# Altium schematic sheet DhruvThakur_PCBSchematic.SchDoc (part 3 of 5)
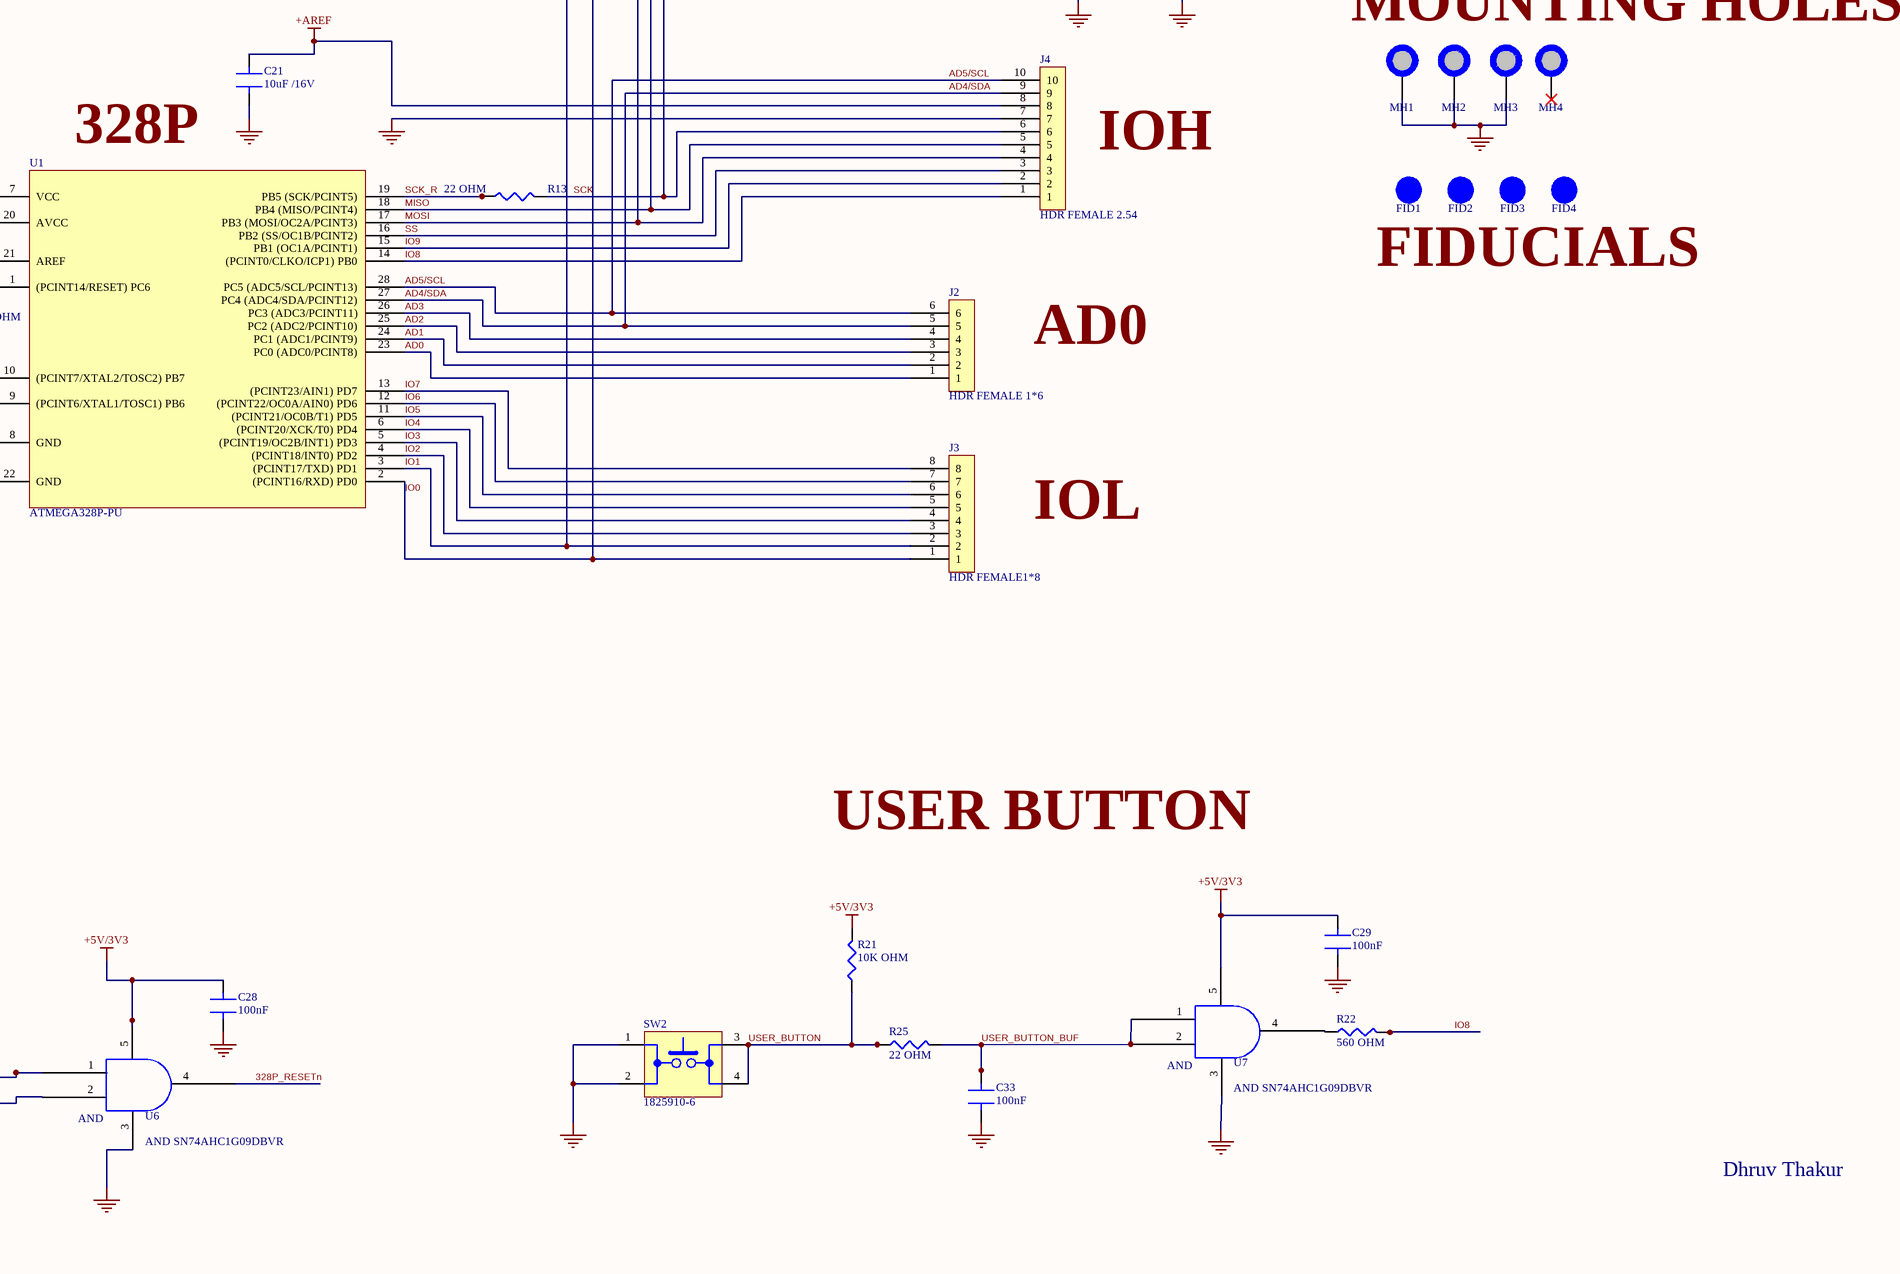
[diagram p5: DhruvThakur_PCBSchematic.SchDoc, bottom right]

## Library data of the parts (continued)
J4 = M20-7821046: Conn Socket Strip Receptacle 10 Position 2.54mm Solder Straight Through Hole Tube; Manufacturer: Harwin; Connector Type: Receptacle, Socket; Contact Resistance: 20mΩ; Current Rating: 3A; Dielectric Material: Polyamide; Hole Diameter: 800µm; Insulation Resistance: 1GΩ; Number of Contacts: 10; Operating Force: 4.8928N; Supplier 1: DigiKey; Manufacturer Part Number: M20-7821046; RoHS: Compliant; Category: Card Edge Connectors; Stock 1: 1361; Pricing 1: 1=1.37, 22=1.10409, 110=0.98555, 506=0.88482, 1012=0.84258, 5016=0.75263, 10010=0.71686 (USD); Case/Package: SIL; Color: Black; Contact Gender: Female; Contact Material: Bronze; Contact Plating: Tin; Depth: 2.5mm; Gender: Female; Housing Color: Black; Housing Material: Polyamide; Lead Pitch: 2.54mm; Length: 25.8mm; Lifecycle Status: Production; Max Current Rating: 3A; Max Operating Temperature: 105°C; Min Operating Temperature: -40°C; Mount: Through Hole; Number of Pins: 10; Number of Positions: 10; Number of Rows: 1; Orientation: Straight; Pitch: 2.54mm; Radiation Hardening: No; REACH SVHC: Yes; Terminal Pitch: 2.54mm; Termination: Solder; ComponentLink1URL: https://datasheet.octopart.com:443/M20-7821046-Harwin-datasheet-176383844.pdf?src-supplier=Electro+Sonic; ComponentLink1Description: https://datasheet.octopart.com:443/M20-7821046-Harwin-datasheet-176383844.pdf?src-supplier=Electro+Sonic; ComponentLink2URL: https://datasheet.octopart.com:443/M20-7821046-Harwin-datasheet-99119574.pdf?src-supplier=Upverter; ComponentLink2Description: https://datasheet.octopart.com:443/M20-7821046-Harwin-datasheet-99119574.pdf?src-supplier=Upverter; ComponentLink3URL: https://datasheet.octopart.com:443/M20-7821046-Harwin-datasheet-526273.pdf?src-supplier=Upverter; ComponentLink3Description: https://datasheet.octopart.com:443/M20-7821046-Harwin-datasheet-526273.pdf?src-supplier=Upverter; ComponentLink4URL: https://datasheet.octopart.com:443/M20-7821046-Harwin-datasheet-96624206.pdf?src-supplier=element14+APAC; ComponentLink4Description: https://datasheet.octopart.com:443/M20-7821046-Harwin-datasheet-96624206.pdf?src-supplier=element14+APAC; ComponentLink5URL: https://datasheet.octopart.com:443/M20-7821046-Harwin-datasheet-6396485.pdf?src-supplier=Newark; ComponentLink5Description: https://datasheet.octopart.com:443/M20-7821046-Harwin-datasheet-6396485.pdf?src-supplier=Newark; ComponentLink6URL: https://datasheet.octopart.com:443/M20-7821046-Harwin-datasheet-32864534.pdf?src-supplier=Newark; ComponentLink6Description: https://datasheet.octopart.com:443/M20-7821046-Harwin-datasheet-32864534.pdf?src-supplier=Newark; ComponentLink7URL: https://datasheet.octopart.com:443/M20-7821046-Harwin-datasheet-15888280.pdf?src-supplier=Newark; ComponentLink7Description: https://datasheet.octopart.com:443/M20-7821046-Harwin-datasheet-15888280.pdf?src-supplier=Newark; ComponentLink8URL: https://datasheet.octopart.com:443/M20-7821046-Harwin-datasheet-188872139.pdf?src-supplier=TME; ComponentLink8Description: https://datasheet.octopart.com:443/M20-7821046-Harwin-datasheet-188872139.pdf?src-supplier=TME; ComponentLink9URL: https://datasheet.octopart.com:443/M20-7821046-Harwin-datasheet-14706651.pdf?src-supplier=Farnell; ComponentLink9Description: https://datasheet.octopart.com:443/M20-7821046-Harwin-datasheet-14706651.pdf?src-supplier=Farnell; ComponentLink10URL: http://sigma.octopart.com:80/15888295/rohs_statement/Harwin-M20-7821046.pdf?src-supplier=Compliance+Statements; ComponentLink10Description: http://sigma.octopart.com:80/15888295/rohs_statement/Harwin-M20-7821046.pdf?src-supplier=Compliance+Statements; Supplier Part Number 1: 952-1847-ND
J5 J6 = 67997-106HLF: Conn; Rect; Header; Unshrouded; 6 Pos; 2.54mm Pitch; 2-Row; Thru-Hole; BergStik; Manufacturer: Amphenol Communications Solutions; Connector Type: Male Pin; Current Rating: 5A; Dielectric Material: Polyethylene; Insulation Resistance: 5GΩ; Lead Length: 3.05mm; Mating Post Length: 5.84mm; Max Voltage Rating (AC): 1.5kV; Number of Contacts: 6; Supplier 1: DigiKey; Manufacturer Part Number: 67997-106HLF; RoHS: Compliant; Category: Headers and Wire Housings; Stock 1: 4552; Pricing 1: 1=0.58, 10=0.49, 400=0.37728, 800=0.35925, 1200=0.34911, 5200=0.31479, 10000=0.3006 (USD); China RoHS: Compliant; Color: Black; Contact Gender: Male; Contact Material: Bronze; Contact Mating Length: 5.842mm; Contact Plating: Gold; Depth: 4.83mm; Flammability Rating: UL94 V-0; Gender: Male; Housing Color: Black; Housing Material: Thermoplastic; Lead Free: Lead Free; Lead Pitch: 2.54mm; Length: 7.62mm; Lifecycle Status: Production; Max Operating Temperature: 130°C; Min Operating Temperature: -65°C; Mount: Through Hole; Number of Pins: 6; Number of Positions: 6; Number of Rows: 2; Orientation: Straight; Pitch: 2.54mm; Radiation Hardening: No; REACH SVHC: Yes; Row Spacing: 2.54mm; Schedule B: 8535908040, 8535908040|8535908040|8535908040|8535908040|8535908040|8535908040|8535908040|8535908040|8535908040|8535908040|8535908040|8535908040|8535908040|8535908040|8535908040|8535908040|8535908040|8535908040|8535908040|8535908040|8535908040|8535908040|8535908040|85; Terminal Pitch: 2.54mm; Termination: Through Hole; Voltage Rating: 1.5kV; ComponentLink1URL: https://datasheet.octopart.com:443/67997-106HLF-Amphenol-Communications-Solutions-datasheet-10288749.pdf?src-supplier=Newark; ComponentLink1Description: https://datasheet.octopart.com:443/67997-106HLF-Amphenol-Communications-Solutions-datasheet-10288749.pdf?src-supplier=Newark; ComponentLink2URL: https://datasheet.octopart.com:443/67997-106HLF-Areva-datasheet-10052131.pdf?src-supplier=Newark; ComponentLink2Description: https://datasheet.octopart.com:443/67997-106HLF-Areva-datasheet-10052131.pdf?src-supplier=Newark; ComponentLink3URL: https://datasheet.octopart.com:443/67997-106HLF-Areva-datasheet-8877144.pdf?src-supplier=Newark; ComponentLink3Description: https://datasheet.octopart.com:443/67997-106HLF-Areva-datasheet-8877144.pdf?src-supplier=Newark; ComponentLink4URL: https://datasheet.octopart.com:443/67997-106HLF-Areva-datasheet-8731571.pdf?src-supplier=Newark; ComponentLink4Description: https://datasheet.octopart.com:443/67997-106HLF-Areva-datasheet-8731571.pdf?src-supplier=Newark; ComponentLink5URL: https://datasheet.octopart.com:443/67997-106HLF-Areva-datasheet-8486089.pdf?src-supplier=Newark; ComponentLink5Description: https://datasheet.octopart.com:443/67997-106HLF-Areva-datasheet-8486089.pdf?src-supplier=Newark; ComponentLink6URL: https://datasheet.octopart.com:443/67997-106HLF-Amphenol-Communications-Solutions-datasheet-36854132.pdf?src-supplier=Farnell; ComponentLink6Description: https://datasheet.octopart.com:443/67997-106HLF-Amphenol-Communications-Solutions-datasheet-36854132.pdf?src-supplier=Farnell; ComponentLink7URL: https://datasheet.octopart.com:443/67997-106HLF-Amphenol-Communications-Solutions-datasheet-20739478.pdf?src-supplier=RS+(Formerly+Allied+Electronics); ComponentLink7Description: https://datasheet.octopart.com:443/67997-106HLF-Amphenol-Communications-Solutions-datasheet-20739478.pdf?src-supplier=RS+(Formerly+Allied+Electronics); ComponentLink8URL: https://datasheet.octopart.com:443/67997-106HLF-Areva-datasheet-118652.pdf?src-supplier=DigiKey; ComponentLink8Description: https://datasheet.octopart.com:443/67997-106HLF-Areva-datasheet-118652.pdf?src-supplier=DigiKey; Supplier Part Number 1: 609-3393-ND
J7 = 10118193-0001LF: USB - micro B USB 2.0 Receptacle Connector 5 Position Surface Mount, Right Angle, Horizontal; Manufacturer: Amphenol Communications Solutions; Connector Type: Receptacle, USB; Contact Resistance: 30mΩ; Current Rating: 1.8A; Dielectric Material: Liquid Crystal Polymer; Insulation Resistance: 1GΩ; Max Voltage Rating (AC): 100V; Number of Contacts: 5; Number of Ports: 1; Operating Force: 35.1392N; Pitch: 650µm; Plating Thickness: 762nm; USB Standard: USB 2.0; Supplier 1: DigiKey; Manufacturer Part Number: 10118193-0001LF; RoHS: Compliant; Category: USB Connectors; Stock 1: 79719; Pricing 1: 1=0.43, 10=0.367, 25=0.3436, 50=0.3272, 100=0.3116, 250=0.29204, 500=0.27808 (USD); China RoHS: Compliant; Color: Black; Contact Gender: Female; Contact Material: Gold, Nickel; Contact Plating: Gold; Depth: 5.67mm; Features: Shielded; Flammability Rating: UL94 V-0; Height: 3mm; Housing Material: Polymer; Length: 7.86mm; Lifecycle Status: Production; Max Operating Temperature: 80°C; Min Operating Temperature: -55°C; Mount: Horizontal, Surface Mount; Number of Pins: 5; Number of Rows: 1; Number of Terminals: 5; Orientation: Right Angle; Radiation Hardening: No; REACH SVHC: Yes; Shell Material: Stainless Steel; Terminal Pitch: 660.4µm; Termination: Solder; Voltage Rating: 100V; ComponentLink1URL: https://datasheet.octopart.com:443/10118193-0001LF-Amphenol-Communications-Solutions-datasheet-182239125.pdf?src-supplier=IHS; ComponentLink1Description: https://datasheet.octopart.com:443/10118193-0001LF-Amphenol-Communications-Solutions-datasheet-182239125.pdf?src-supplier=IHS; ComponentLink2URL: https://datasheet.octopart.com:443/10118193-0001LF-Amphenol-Communications-Solutions-datasheet-55953155.pdf?src-supplier=TME; ComponentLink2Description: https://datasheet.octopart.com:443/10118193-0001LF-Amphenol-Communications-Solutions-datasheet-55953155.pdf?src-supplier=TME; ComponentLink3URL: https://datasheet.octopart.com:443/10118193-0001LF-Amphenol-ICC-datasheet-116246833.pdf?src-supplier=Upverter; ComponentLink3Description: https://datasheet.octopart.com:443/10118193-0001LF-Amphenol-ICC-datasheet-116246833.pdf?src-supplier=Upverter; ComponentLink4URL: https://datasheet.octopart.com:443/10118193-0001LF-FCI-datasheet-141913714.pdf?src-supplier=Upverter; ComponentLink4Description: https://datasheet.octopart.com:443/10118193-0001LF-FCI-datasheet-141913714.pdf?src-supplier=Upverter; ComponentLink5URL: https://datasheet.octopart.com:443/10118193-0001LF-Amphenol-Communications-Solutions-datasheet-96019471.pdf?src-supplier=element14+APAC; ComponentLink5Description: https://datasheet.octopart.com:443/10118193-0001LF-Amphenol-Communications-Solutions-datasheet-96019471.pdf?src-supplier=element14+APAC; ComponentLink6URL: https://datasheet.octopart.com:443/10118193-0001LF-Amphenol-Communications-Solutions-datasheet-11792339.pdf?src-supplier=Electro+Sonic; ComponentLink6Description: https://datasheet.octopart.com:443/10118193-0001LF-Amphenol-Communications-Solutions-datasheet-11792339.pdf?src-supplier=Electro+Sonic; ComponentLink7URL: https://datasheet.octopart.com:443/10118193-0001LF-Amphenol-Communications-Solutions-datasheet-13702206.pdf?src-supplier=RS+(Formerly+Allied+Electronics); ComponentLink7Description: https://datasheet.octopart.com:443/10118193-0001LF-Amphenol-Communications-Solutions-datasheet-13702206.pdf?src-supplier=RS+(Formerly+Allied+Electronics); Supplier Part Number 1: 609-4616-6-ND
J8 J9 = PAD_WITH_HOLE_4MMX1.5MM
JP1 JP4 = 68000-103HLF: Pin Header, Board-to-Board, 2.54 mm, 1 Rows, 3 Contacts, Through Hole, FCI BergStik II 68000; Manufacturer: Amphenol Communications Solutions; Connector Type: Male Pin; Current Rating: 3A; Dielectric Material: Polyethylene; Gender: Male; Insulation Resistance: 5GΩ; Lead Length: 2.41mm; Mating Post Length: 5.84mm; Max Voltage Rating (AC): 1.5kV; Number of Contacts: 3; Pitch: 2.54mm; Plating Thickness: 762nm; Voltage Rating: 1.05kV; Supplier 1: DigiKey; Manufacturer Part Number: 68000-103HLF; RoHS: Compliant; Category: Headers and Wire Housings; Stock 1: 65511; Pricing 1: 1=0.31, 10=0.266, 100=0.2257, 500=0.20142, 4000=0.17391, 8000=0.1656, 12000=0.16093 (USD); China RoHS: Compliant; Color: Black; Contact Gender: Male; Contact Material: Gold; Contact Mating Length: 5.842mm; Contact Plating: Gold; Depth: 2.41mm; Flammability Rating: UL94 V-0; Height: 8.73mm; Housing Color: Black; Housing Material: Thermoplastic; Lead Pitch: 2.54mm; Length: 7.62mm; Lifecycle Status: Production; Max Operating Temperature: 125°C; Min Operating Temperature: -65°C; Mount: Through Hole; Number of Pins: 3; Number of Positions: 3; Number of Rows: 1; Orientation: Straight; Packaging: Bulk; Radiation Hardening: No; REACH SVHC: Yes; Terminal Pitch: 2.54mm; Termination: Solder; ComponentLink1URL: https://datasheet.octopart.com:443/68000-103HLF-Amphenol-ICC---FCI-datasheet-155511504.pdf?src-supplier=Upverter; ComponentLink1Description: https://datasheet.octopart.com:443/68000-103HLF-Amphenol-ICC---FCI-datasheet-155511504.pdf?src-supplier=Upverter; ComponentLink2URL: https://datasheet.octopart.com:443/68000-103HLF-Amphenol-Communications-Solutions-datasheet-10088795.pdf?src-supplier=Farnell; ComponentLink2Description: https://datasheet.octopart.com:443/68000-103HLF-Amphenol-Communications-Solutions-datasheet-10088795.pdf?src-supplier=Farnell; ComponentLink3URL: https://datasheet.octopart.com:443/68000-103HLF-Amphenol-Communications-Solutions-datasheet-41232361.pdf?src-supplier=Farnell; ComponentLink3Description: https://datasheet.octopart.com:443/68000-103HLF-Amphenol-Communications-Solutions-datasheet-41232361.pdf?src-supplier=Farnell; ComponentLink4URL: https://datasheet.octopart.com:443/68000-103HLF-Areva-datasheet-8861575.pdf?src-supplier=Newark; ComponentLink4Description: https://datasheet.octopart.com:443/68000-103HLF-Areva-datasheet-8861575.pdf?src-supplier=Newark; ComponentLink5URL: https://datasheet.octopart.com:443/68000-103HLF-Areva-datasheet-8713716.pdf?src-supplier=Newark; ComponentLink5Description: https://datasheet.octopart.com:443/68000-103HLF-Areva-datasheet-8713716.pdf?src-supplier=Newark; ComponentLink6URL: https://datasheet.octopart.com:443/68000-103HLF-Areva-datasheet-8449737.pdf?src-supplier=Newark; ComponentLink6Description: https://datasheet.octopart.com:443/68000-103HLF-Areva-datasheet-8449737.pdf?src-supplier=Newark; ComponentLink7URL: https://datasheet.octopart.com:443/68000-103HLF-Amphenol-Communications-Solutions-datasheet-154727322.pdf?src-supplier=Electro+Sonic; ComponentLink7Description: https://datasheet.octopart.com:443/68000-103HLF-Amphenol-Communications-Solutions-datasheet-154727322.pdf?src-supplier=Electro+Sonic; ComponentLink8URL: https://datasheet.octopart.com:443/68000-103HLF-Amphenol-Communications-Solutions-datasheet-100449246.pdf?src-supplier=TME; ComponentLink8Description: https://datasheet.octopart.com:443/68000-103HLF-Amphenol-Communications-Solutions-datasheet-100449246.pdf?src-supplier=TME; ComponentLink9URL: https://datasheet.octopart.com:443/68000-103HLF-Amphenol-datasheet-170317325.pdf?src-supplier=Amar+Radio+Corporation; ComponentLink9Description: https://datasheet.octopart.com:443/68000-103HLF-Amphenol-datasheet-170317325.pdf?src-supplier=Amar+Radio+Corporation; ComponentLink10URL: https://datasheet.octopart.com:443/68000-103HLF-Amphenol-Communications-Solutions-datasheet-13448982.pdf?src-supplier=RS+(Formerly+Allied+Electronics); ComponentLink10Description: https://datasheet.octopart.com:443/68000-103HLF-Amphenol-Communications-Solutions-datasheet-13448982.pdf?src-supplier=RS+(Formerly+Allied+Electronics); Supplier Part Number 1: 609-3461-ND
JP2 = 10-89-7041: Conn Unshrouded Header HDR 4 POS 2.54mm Solder ST Top Entry Thru-HoleC-Grid Bag; Manufacturer: Molex; Manufacturer Lifecycle Status: ACTIVE; Connector Type: Male Pin; Contact Resistance: 15mΩ; Current Rating: 3A; Dielectric Material: Polyethylene; Glow Wire Compliant: Non-compliant; Insulation Resistance: 1GΩ; Number of Circuits: 4; Plating: Tin; Plating Thickness: 3.81µm; Voltage Rating: 250V; Supplier 1: DigiKey; Manufacturer Part Number: 10-89-7041; RoHS: Compliant; Category: Headers and Wire Housings; Stock 1: 4005; Pricing 1: 1=0.56, 10=0.472, 100=0.4007, 500=0.35766, 1000=0.34057, 5000=0.304, 10000=0.2895 (USD); China RoHS: Compliant; Color: Black; Contact Gender: Male; Contact Material: Brass; Contact Mating Length: 6.096mm; Contact Plating: Tin; Country of Origin: US; ELV: Compliant; Flammability Rating: UL94 V-0; Halogen Free: Low Halogen; Housing Color: Black; Housing Material: Thermoplastic; Lead Free: Lead Free; Lead Pitch: 2.54mm; Lifecycle Status: Production; Max Operating Temperature: 105°C; Min Operating Temperature: -40°C; Mount: Through Hole; Number of Contacts: 4; Number of Pins: 4; Number of Positions: 4; Number of Rows: 2; Orientation: Vertical; Packaging: Bulk; Pitch: 2.54mm; REACH SVHC: Yes; Row Spacing: 2.54mm; Terminal Pitch: 2.54mm; Termination: Solder; Voltage Rating (DC): 250V; ComponentLink1URL: https://datasheet.octopart.com:443/10-89-7041-Molex-datasheet-138896924.pdf?src-supplier=Newark; ComponentLink1Description: https://datasheet.octopart.com:443/10-89-7041-Molex-datasheet-138896924.pdf?src-supplier=Newark; ComponentLink2URL: https://datasheet.octopart.com:443/10-89-7041-Molex-datasheet-13784515.pdf?src-supplier=Molex; ComponentLink2Description: https://datasheet.octopart.com:443/10-89-7041-Molex-datasheet-13784515.pdf?src-supplier=Molex; ComponentLink3URL: https://sigma.octopart.com:443/8377736/technical_drawing/Molex-10-89-7041.pdf?src-supplier=Molex; ComponentLink3Description: https://sigma.octopart.com:443/8377736/technical_drawing/Molex-10-89-7041.pdf?src-supplier=Molex; ComponentLink4URL: https://datasheet.octopart.com:443/010897041-Molex-datasheet-8335915.pdf?src-supplier=Molex; ComponentLink4Description: https://datasheet.octopart.com:443/010897041-Molex-datasheet-8335915.pdf?src-supplier=Molex; ComponentLink5URL: https://datasheet.octopart.com:443/10-89-7041-Molex-datasheet-154742889.pdf?src-supplier=Master+Electronics; ComponentLink5Description: https://datasheet.octopart.com:443/10-89-7041-Molex-datasheet-154742889.pdf?src-supplier=Master+Electronics; ComponentLink6URL: https://datasheet.octopart.com:443/10-89-7041-Molex-datasheet-62102714.pdf?src-supplier=Electro+Sonic; ComponentLink6Description: https://datasheet.octopart.com:443/10-89-7041-Molex-datasheet-62102714.pdf?src-supplier=Electro+Sonic; ComponentLink7URL: https://datasheet.octopart.com:443/10-89-7041-Molex-datasheet-37167734.pdf?src-supplier=Electro+Sonic; ComponentLink7Description: https://datasheet.octopart.com:443/10-89-7041-Molex-datasheet-37167734.pdf?src-supplier=Electro+Sonic; ComponentLink8URL: https://datasheet.octopart.com:443/10-89-7041-Molex-datasheet-23708294.pdf?src-supplier=Electro+Sonic; ComponentLink8Description: https://datasheet.octopart.com:443/10-89-7041-Molex-datasheet-23708294.pdf?src-supplier=Electro+Sonic; ComponentLink9URL: https://datasheet.octopart.com:443/10-89-7041-Molex-datasheet-154284.pdf?src-supplier=Mouser; ComponentLink9Description: https://datasheet.octopart.com:443/10-89-7041-Molex-datasheet-154284.pdf?src-supplier=Mouser; ComponentLink10URL: https://datasheet.octopart.com:443/10-89-7041-Molex-datasheet-120117.pdf?src-supplier=DigiKey; ComponentLink10Description: https://datasheet.octopart.com:443/10-89-7041-Molex-datasheet-120117.pdf?src-supplier=DigiKey; ComponentLink11URL: http://sigma.octopart.com:80/15617102/rohs_certificate/Molex-10-89-7041.pdf?src-supplier=Compliance+Statements; ComponentLink11Description: http://sigma.octopart.com:80/15617102/rohs_certificate/Molex-10-89-7041.pdf?src-supplier=Compliance+Statements; ComponentLink12URL: http://sigma.octopart.com:80/conflict_mineral_statement/Molex-company-72.pdf?src-supplier=Compliance+Statements; ComponentLink12Description: http://sigma.octopart.com:80/conflict_mineral_statement/Molex-company-72.pdf?src-supplier=Compliance+Statements; ComponentLink13URL: http://sigma.octopart.com:80/rohs_statement/Molex-company-73.pdf?src-supplier=Compliance+Statements; ComponentLink13Description: http://sigma.octopart.com:80/rohs_statement/Molex-company-73.pdf?src-supplier=Compliance+Statements; ComponentLink14URL: http://sigma.octopart.com:80/reach_statement/Molex-company-74.pdf?src-supplier=Compliance+Statements; ComponentLink14Description: http://sigma.octopart.com:80/reach_statement/Molex-company-74.pdf?src-supplier=Compliance+Statements; Supplier Part Number 1: WM50022-04-ND
JP3 = 68001-204HLF: Conn Unshrouded Header HDR 4 POS 2.54mm Solder ST Top Entry Thru-Hole BergStik® Bulk; Manufacturer: Amphenol Communications Solutions; Connector Type: Male Pin; Current Rating: 3A; Gender: Male; Insulation Resistance: 5GΩ; Lead Length: 3.05mm; Mating Post Length: 5.84mm; Number of Contacts: 4; Voltage Rating: 1.5kV; Supplier 1: DigiKey; Manufacturer Part Number: 68001-204HLF; RoHS: Compliant; Category: Headers and Wire Housings; Stock 1: 2342; Pricing 1: 1=0.47, 10=0.401, 100=0.3406, 500=0.30394, 1000=0.28942, 5000=0.25834, 10000=0.24602 (USD); China RoHS: Compliant; Color: Black; Contact Gender: Male; Contact Material: Bronze; Contact Mating Length: 5.842mm; Contact Plating: GXT, Gold; Flammability Rating: UL94 V-0; Housing Material: Thermoplastic; Lead Pitch: 2.54mm; Lifecycle Status: Production; Max Operating Temperature: 130°C; Min Operating Temperature: -65°C; Mount: Through Hole; Number of Pins: 4; Number of Positions: 4; Number of Rows: 1; Orientation: Straight; Packaging: Bulk; Pitch: 2.54mm; Radiation Hardening: No; REACH SVHC: Yes; Schedule B: 8535908040; Terminal Pitch: 2.54mm; Termination: Solder; ComponentLink1URL: https://datasheet.octopart.com:443/68001-204HLF-Amphenol-Communications-Solutions-datasheet-151206381.pdf?src-supplier=IHS; ComponentLink1Description: https://datasheet.octopart.com:443/68001-204HLF-Amphenol-Communications-Solutions-datasheet-151206381.pdf?src-supplier=IHS; ComponentLink2URL: https://datasheet.octopart.com:443/68001-204HLF-Amphenol-Communications-Solutions-datasheet-154727322.pdf?src-supplier=Master+Electronics; ComponentLink2Description: https://datasheet.octopart.com:443/68001-204HLF-Amphenol-Communications-Solutions-datasheet-154727322.pdf?src-supplier=Master+Electronics; ComponentLink3URL: https://datasheet.octopart.com:443/68001-204HLF-Amphenol-Communications-Solutions-datasheet-41232361.pdf?src-supplier=element14+APAC; ComponentLink3Description: https://datasheet.octopart.com:443/68001-204HLF-Amphenol-Communications-Solutions-datasheet-41232361.pdf?src-supplier=element14+APAC; ComponentLink4URL: https://datasheet.octopart.com:443/68001-204HLF-Amphenol-Communications-Solutions-datasheet-100449246.pdf?src-supplier=Future+Electronics; ComponentLink4Description: https://datasheet.octopart.com:443/68001-204HLF-Amphenol-Communications-Solutions-datasheet-100449246.pdf?src-supplier=Future+Electronics; ComponentLink5URL: https://datasheet.octopart.com:443/68001-204HLF-Amphenol-Communications-Solutions-datasheet-20739502.pdf?src-supplier=RS+(Formerly+Allied+Electronics); ComponentLink5Description: https://datasheet.octopart.com:443/68001-204HLF-Amphenol-Communications-Solutions-datasheet-20739502.pdf?src-supplier=RS+(Formerly+Allied+Electronics); Supplier Part Number 1: 609-3402-ND
L1 = BRL3225T2R2M: Inductor Power Chip Wirewound 2.2uH 20% 100KHz Ferrite 1.6A 78mOhm DCR 1210 T/R; Manufacturer: Taiyo Yuden; DC Resistance (DCR): 78mΩ; Inductance: 2.2µH; Max Saturation Current: 1.85A; Number of Circuits: 1; Self Resonant Frequency: 150MHz; Shielding: No; Supplier 1: DigiKey; Manufacturer Part Number: BRL3225T2R2M; RoHS: Compliant; Category: Fixed Inductors; Stock 1: 13918; Pricing 1: 1=0.18, 10=0.146, 100=0.1199, 1000=0.09857, 2000=0.09294, 4000=0.08763, 6000=0.08467, 10000=0.08108, 14000=0.07881, 20000=0.07646, 50000=0.07077, 100000=0.06859 (USD); Case/Package: 1210; Case Code (Imperial): 1210; Case Code (Metric): 3225; Composition: Wirewound; Core Material: Ferrite; Current Rating: 1.6A; DC Current: 1.6A; Depth: 2.7mm; Halogen Free: Halogen Free; Height: 1.7mm; Height - Seated (Max): 1.7018mm; Inductance Tolerance: 20%; Length: 3.2mm; Lifecycle Status: Production; Max Current Rating: 1.6A; Max DC Current: 1.6A; Max Length: 3.4mm; Max Operating Temperature: 105°C; Max Temperature Rise Current: 1.6A; Max Width: 2.7mm; Military Standard: Not; Min Length: 3mm; Min Operating Temperature: -40°C; Min Width: 2.3mm; Mount: Surface Mount; Number of Pins: 2; Number of Terminals: 2; Radiation Hardening: No; REACH SVHC: Yes; Saturation Current: 1.85A; Termination: SMD/SMT; Test Frequency: 100kHz; Tolerance: 20%; Width: 2.5mm; ComponentLink1URL: https://datasheet.octopart.com:443/BRL3225T2R2M-Taiyo-Yuden-datasheet-181258246.pdf?src-supplier=element14+APAC; ComponentLink1Description: https://datasheet.octopart.com:443/BRL3225T2R2M-Taiyo-Yuden-datasheet-181258246.pdf?src-supplier=element14+APAC; ComponentLink2URL: https://datasheet.octopart.com:443/BRL3225T2R2M-Taiyo-Yuden-datasheet-41181393.pdf?src-supplier=element14+APAC; ComponentLink2Description: https://datasheet.octopart.com:443/BRL3225T2R2M-Taiyo-Yuden-datasheet-41181393.pdf?src-supplier=element14+APAC; ComponentLink3URL: https://datasheet.octopart.com:443/BRL3225T2R2M-Taiyo-Yuden-datasheet-17271620.pdf?src-supplier=Farnell; ComponentLink3Description: https://datasheet.octopart.com:443/BRL3225T2R2M-Taiyo-Yuden-datasheet-17271620.pdf?src-supplier=Farnell; ComponentLink4URL: https://datasheet.octopart.com:443/BRL3225T2R2M-Taiyo-Yuden-datasheet-154807570.pdf?src-supplier=JRH+Electronics; ComponentLink4Description: https://datasheet.octopart.com:443/BRL3225T2R2M-Taiyo-Yuden-datasheet-154807570.pdf?src-supplier=JRH+Electronics; ComponentLink5URL: https://datasheet.octopart.com:443/BRL3225T2R2M-Taiyo-Yuden-datasheet-65850814.pdf?src-supplier=Newark; ComponentLink5Description: https://datasheet.octopart.com:443/BRL3225T2R2M-Taiyo-Yuden-datasheet-65850814.pdf?src-supplier=Newark; ComponentLink6URL: https://datasheet.octopart.com:443/BRL3225T2R2M-Taiyo-Yuden-datasheet-13712620.pdf?src-supplier=Factory+Futures; ComponentLink6Description: https://datasheet.octopart.com:443/BRL3225T2R2M-Taiyo-Yuden-datasheet-13712620.pdf?src-supplier=Factory+Futures; ComponentLink7URL: https://datasheet.octopart.com:443/BRL3225T2R2M-Taiyo-Yuden-datasheet-141251735.pdf?src-supplier=Taiyo+Yuden+SCT; ComponentLink7Description: https://datasheet.octopart.com:443/BRL3225T2R2M-Taiyo-Yuden-datasheet-141251735.pdf?src-supplier=Taiyo+Yuden+SCT; ComponentLink8URL: https://datasheet.octopart.com:443/BRL3225T2R2M-Taiyo-Yuden-datasheet-134564583.pdf?src-supplier=Future+Electronics; ComponentLink8Description: https://datasheet.octopart.com:443/BRL3225T2R2M-Taiyo-Yuden-datasheet-134564583.pdf?src-supplier=Future+Electronics; ComponentLink9URL: https://datasheet.octopart.com:443/BRL3225T2R2M-Taiyo-Yuden-datasheet-100484901.pdf?src-supplier=Future+Electronics; ComponentLink9Description: https://datasheet.octopart.com:443/BRL3225T2R2M-Taiyo-Yuden-datasheet-100484901.pdf?src-supplier=Future+Electronics; ComponentLink10URL: https://datasheet.octopart.com:443/BRL3225T2R2M-Taiyo-Yuden-datasheet-62109174.pdf?src-supplier=Electro+Sonic; ComponentLink10Description: https://datasheet.octopart.com:443/BRL3225T2R2M-Taiyo-Yuden-datasheet-62109174.pdf?src-supplier=Electro+Sonic; ComponentLink11URL: https://datasheet.octopart.com:443/BRL3225T2R2M-Taiyo-Yuden-datasheet-10283011.pdf?src-supplier=element14; ComponentLink11Description: https://datasheet.octopart.com:443/BRL3225T2R2M-Taiyo-Yuden-datasheet-10283011.pdf?src-supplier=element14; ComponentLink12URL: https://datasheet.octopart.com:443/BRL3225T2R2M-Taiyo-Yuden-datasheet-8853019.pdf?src-supplier=element14; ComponentLink12Description: https://datasheet.octopart.com:443/BRL3225T2R2M-Taiyo-Yuden-datasheet-8853019.pdf?src-supplier=element14; Supplier Part Number 1: 587-2165-1-ND
LINK1-LINK3 = QPC02SXGN-RC: 2 Position 2.54 mm Centerline Single Circuit Open Top Jumper; Manufacturer: Sullins; Current Rating: 3A; Number of Contacts: 2; Pitch: 2.54mm; Supplier 1: DigiKey; Manufacturer Part Number: QPC02SXGN-RC; RoHS: Compliant; Category: Connectors; Stock 1: 1258703; Pricing 1: 1=0.1, 10=0.025, 25=0.0236, 50=0.0224, 100=0.0213, 250=0.02, 500=0.01904, 2000=0.01726, 4000=0.01644 (USD); Case/Package: 100; Contact Gender: Female; Contact Material: Brass; Contact Plating: Gold; Height: 6.17mm; Lead Free: Lead Free; Lifecycle Status: Production; Max Operating Temperature: 85°C; Min Operating Temperature: -40°C; Number of Pins: 1; Number of Positions: 2; Packaging: Bulk; REACH SVHC: Yes; ComponentLink1URL: https://datasheet.octopart.com:443/QPC02SXGN-RC-Sullins-datasheet-138898435.pdf?src-supplier=ODG+(Origin+Data+Global); ComponentLink1Description: https://datasheet.octopart.com:443/QPC02SXGN-RC-Sullins-datasheet-138898435.pdf?src-supplier=ODG+(Origin+Data+Global); ComponentLink2URL: https://datasheet.octopart.com:443/QPC02SXGN-RC-Sullins-datasheet-12521006.pdf?src-supplier=IHS; ComponentLink2Description: https://datasheet.octopart.com:443/QPC02SXGN-RC-Sullins-datasheet-12521006.pdf?src-supplier=IHS; ComponentLink3URL: https://sigma.octopart.com:443/138898456/technical_drawing/Sullins-QPC02SXGN-RC.pdf?src-supplier=Upverter; ComponentLink3Description: https://sigma.octopart.com:443/138898456/technical_drawing/Sullins-QPC02SXGN-RC.pdf?src-supplier=Upverter; ComponentLink4URL: https://datasheet.octopart.com:443/QPC02SXGN-RC-Sullins-datasheet-41399305.pdf?src-supplier=Future+Electronics; ComponentLink4Description: https://datasheet.octopart.com:443/QPC02SXGN-RC-Sullins-datasheet-41399305.pdf?src-supplier=Future+Electronics; Supplier Part Number 1: S9337-ND
MH1-MH4 = MH_7.4MM_3.2MM: MOUNTING HOLE 7.4MM DIAMETER, 3.2 MM DRILL
R1 = RC0805FR-07100KL (2): 125mW Thick Film Resistors 150V ±100ppm/℃ ±1% 100kΩ 0805 Chip Resistor - Surface Mount ROHS; Manufacturer: Yageo Group; Temperature Coefficient: 100ppm/°C; Supplier 1: DigiKey; Manufacturer Part Number: RC0805FR-07100KL; RoHS: Compliant; Category: Chip SMD Resistors; Stock 1: 488030; Pricing 1: 1=0.12, 10=0.016, 25=0.0148, 50=0.0132, 100=0.0082 (USD); Case/Package: 0805; Case Code (Imperial): 0805; China RoHS: Non-Compliant; Composition: Thick Film; Depth: 1.25mm; Features: Moisture Resistant; Height: 500µm; Lead Free: Lead Free; Lead Pitch: 400µm; Length: 2mm; Lifecycle Status: Production; Max Operating Temperature: 155°C; Max Power Dissipation: 125mW; Military Standard: Not; Min Operating Temperature: -55°C; Mount: Surface Mount; Number of Pins: 2; Number of Terminals: 2; Number of Terminations: 2; Packaging: Tape & Reel; Power Dissipation: 125mW; Power Rating: 125mW; REACH SVHC: Yes; Resistance: 100kΩ; Schedule B: 8533210045, 8533210045|8533210045, 8533210045|8533210045|8533210045, 8533210045|8533210045|8533210045|8533210045; Termination: SMD/SMT; Tolerance: 1%; Voltage Rating: 150V; Voltage Rating (AC): 150V; Voltage Rating (DC): 150V; Width: 1.25mm; Working Voltage: 150V; ComponentLink1URL: https://datasheet.octopart.com:443/RC0805FR-07100KL-Yageo-datasheet-175887523.pdf?src-supplier=IHS; ComponentLink1Description: https://datasheet.octopart.com:443/RC0805FR-07100KL-Yageo-datasheet-175887523.pdf?src-supplier=IHS; ComponentLink2URL: https://datasheet.octopart.com:443/RC0805FR-07100KL-Yageo-datasheet-164759695.pdf?src-supplier=Upverter; ComponentLink2Description: https://datasheet.octopart.com:443/RC0805FR-07100KL-Yageo-datasheet-164759695.pdf?src-supplier=Upverter; ComponentLink3URL: https://datasheet.octopart.com:443/RC0805FR-07100KL-Yageo-datasheet-103092701.pdf?src-supplier=Upverter; ComponentLink3Description: https://datasheet.octopart.com:443/RC0805FR-07100KL-Yageo-datasheet-103092701.pdf?src-supplier=Upverter; ComponentLink4URL: https://sigma.octopart.com:443/138820526/technical_drawing/Yageo-RC0805FR-07100KL.pdf?src-supplier=Upverter; ComponentLink4Description: https://sigma.octopart.com:443/138820526/technical_drawing/Yageo-RC0805FR-07100KL.pdf?src-supplier=Upverter; ComponentLink5URL: https://datasheet.octopart.com:443/RC0805FR-07100KL-Yageo-datasheet-118657.pdf?src-supplier=DigiKey; ComponentLink5Description: https://datasheet.octopart.com:443/RC0805FR-07100KL-Yageo-datasheet-118657.pdf?src-supplier=DigiKey; ComponentLink6URL: https://datasheet.octopart.com:443/RC0805FR-07100KL-Yageo-datasheet-8330313.pdf?src-supplier=element14+APAC; ComponentLink6Description: https://datasheet.octopart.com:443/RC0805FR-07100KL-Yageo-datasheet-8330313.pdf?src-supplier=element14+APAC; ComponentLink7URL: https://datasheet.octopart.com:443/RC0805FR-07100KL-Yageo-datasheet-12592811.pdf?src-supplier=element14+APAC; ComponentLink7Description: https://datasheet.octopart.com:443/RC0805FR-07100KL-Yageo-datasheet-12592811.pdf?src-supplier=element14+APAC; ComponentLink8URL: https://datasheet.octopart.com:443/RC0805FR-07100KL-Yageo-datasheet-62067350.pdf?src-supplier=Farnell; ComponentLink8Description: https://datasheet.octopart.com:443/RC0805FR-07100KL-Yageo-datasheet-62067350.pdf?src-supplier=Farnell; ComponentLink9URL: https://datasheet.octopart.com:443/RC0805FR-07100KL-Yageo-datasheet-13691069.pdf?src-supplier=Farnell; ComponentLink9Description: https://datasheet.octopart.com:443/RC0805FR-07100KL-Yageo-datasheet-13691069.pdf?src-supplier=Farnell; ComponentLink10URL: https://datasheet.octopart.com:443/RC0805FR-07100KL-Yageo-datasheet-127823281.pdf?src-supplier=Future+Electronics; ComponentLink10Description: https://datasheet.octopart.com:443/RC0805FR-07100KL-Yageo-datasheet-127823281.pdf?src-supplier=Future+Electronics; ComponentLink11URL: https://datasheet.octopart.com:443/RC0805FR-07100KL-Yageo-datasheet-137700087.pdf?src-supplier=Future+Electronics; ComponentLink11Description: https://datasheet.octopart.com:443/RC0805FR-07100KL-Yageo-datasheet-137700087.pdf?src-supplier=Future+Electronics; ComponentLink12URL: https://datasheet.octopart.com:443/RC0805FR-07100KL-Yageo-datasheet-77992522.pdf?src-supplier=Future+Electronics; ComponentLink12Description: https://datasheet.octopart.com:443/RC0805FR-07100KL-Yageo-datasheet-77992522.pdf?src-supplier=Future+Electronics; ComponentLink13URL: https://datasheet.octopart.com:443/RC0805FR-07100KL-Yageo-datasheet-80324437.pdf?src-supplier=Future+Electronics; ComponentLink13Description: https://datasheet.octopart.com:443/RC0805FR-07100KL-Yageo-datasheet-80324437.pdf?src-supplier=Future+Electronics; ComponentLink14URL: https://datasheet.octopart.com:443/RC0805FR-07100KL-Yageo-datasheet-67302840.pdf?src-supplier=Future+Electronics; ComponentLink14Description: https://datasheet.octopart.com:443/RC0805FR-07100KL-Yageo-datasheet-67302840.pdf?src-supplier=Future+Electronics; ComponentLink15URL: https://datasheet.octopart.com:443/RC0805FR-07100KL-Yageo-datasheet-8324252.pdf?src-supplier=Future+Electronics; ComponentLink15Description: https://datasheet.octopart.com:443/RC0805FR-07100KL-Yageo-datasheet-8324252.pdf?src-supplier=Future+Electronics; ComponentLink16URL: https://datasheet.octopart.com:443/RC0805FR-07100KL-Yageo-datasheet-79472498.pdf?src-supplier=Megastar; ComponentLink16Description: https://datasheet.octopart.com:443/RC0805FR-07100KL-Yageo-datasheet-79472498.pdf?src-supplier=Megastar; ComponentLink17URL: https://datasheet.octopart.com:443/RC0805FR-07100KL-Yageo-datasheet-27714392.pdf?src-supplier=Seeed+Studio; ComponentLink17Description: https://datasheet.octopart.com:443/RC0805FR-07100KL-Yageo-datasheet-27714392.pdf?src-supplier=Seeed+Studio; ComponentLink18URL: https://datasheet.octopart.com/RC0805FR-07100KL-Yageo-datasheet-73766026.pdf; ComponentLink18Description: https://datasheet.octopart.com/RC0805FR-07100KL-Yageo-datasheet-73766026.pdf; ComponentLink19URL: https://datasheet.octopart.com:443/RC0805FR-07100KL-Yageo-datasheet-502840.pdf?src-supplier=element14; ComponentLink19Description: https://datasheet.octopart.com:443/RC0805FR-07100KL-Yageo-datasheet-502840.pdf?src-supplier=element14; ComponentLink20URL: http://sigma.octopart.com:80/rohs_statement/Yageo-company-2.pdf?src-supplier=Compliance+Statements; ComponentLink20Description: http://sigma.octopart.com:80/rohs_statement/Yageo-company-2.pdf?src-supplier=Compliance+Statements; ComponentLink21URL: http://sigma.octopart.com:80/conflict_mineral_statement/Yageo-company-3.pdf?src-supplier=Compliance+Statements; ComponentLink21Description: http://sigma.octopart.com:80/conflict_mineral_statement/Yageo-company-3.pdf?src-supplier=Compliance+Statements; Supplier Part Number 1: 311-100KCRCT-ND
R2 R3 R15 R17 R22 = RC0805FR-07560RL: Res Thick Film 0805 560 Ohm 1% 0.125W(1/8W) ±100ppm/C Pad SMD T/R; Manufacturer: Yageo Group; Max Power Dissipation: 125mW; Resistance: 560Ω; Temperature Coefficient: 100ppm/°C; Voltage Rating: 150V; Supplier 1: DigiKey; Manufacturer Part Number: RC0805FR-07560RL; RoHS: Compliant; Category: Chip SMD Resistors; Stock 1: 675; Pricing 1: 1=0.1, 10=0.008, 25=0.0072 (USD); Case/Package: 0805; Case Code (Imperial): 0805; China RoHS: Non-Compliant; Composition: Thick Film; Depth: 1.25mm; Features: Moisture Resistant; Height: 500µm; Lead Free: Lead Free; Length: 2mm; Lifecycle Status: Production; Max Operating Temperature: 155°C; Military Standard: Not; Min Operating Temperature: -55°C; Mount: Surface Mount; Number of Pins: 2; Number of Terminals: 2; Number of Terminations: 2; Packaging: Tape & Reel; Power Dissipation: 125mW; Power Rating: 125mW; REACH SVHC: Yes; Schedule B: 8533210045, 8533210045|8533210045, 8533210045|8533210045|8533210045, 8533210045|8533210045|8533210045|8533210045; Termination: SMD/SMT; Tolerance: 1%; Voltage Rating (AC): 150V; Voltage Rating (DC): 150V; Weight: 5.499807mg; Width: 1.25mm; Working Voltage: 150V; ComponentLink1URL: https://datasheet.octopart.com:443/RC0805FR-07560RL-Yageo-datasheet-175887523.pdf?src-supplier=Newark; ComponentLink1Description: https://datasheet.octopart.com:443/RC0805FR-07560RL-Yageo-datasheet-175887523.pdf?src-supplier=Newark; ComponentLink2URL: https://datasheet.octopart.com:443/RC0805FR-07560RL-Yageo-datasheet-8328172.pdf?src-supplier=Newark; ComponentLink2Description: https://datasheet.octopart.com:443/RC0805FR-07560RL-Yageo-datasheet-8328172.pdf?src-supplier=Newark; ComponentLink3URL: https://datasheet.octopart.com:443/RC0805FR-07560RL-Yageo-datasheet-103092701.pdf?src-supplier=Upverter; ComponentLink3Description: https://datasheet.octopart.com:443/RC0805FR-07560RL-Yageo-datasheet-103092701.pdf?src-supplier=Upverter; ComponentLink4URL: https://datasheet.octopart.com:443/RC0805FR-07560RL-Yageo-datasheet-8330313.pdf?src-supplier=element14+APAC; ComponentLink4Description: https://datasheet.octopart.com:443/RC0805FR-07560RL-Yageo-datasheet-8330313.pdf?src-supplier=element14+APAC; ComponentLink5URL: https://datasheet.octopart.com:443/RC0805FR-07560RL-Yageo-datasheet-62067350.pdf?src-supplier=element14+APAC; ComponentLink5Description: https://datasheet.octopart.com:443/RC0805FR-07560RL-Yageo-datasheet-62067350.pdf?src-supplier=element14+APAC; ComponentLink6URL: https://datasheet.octopart.com:443/RC0805FR-07560RL-Yageo-datasheet-164759695.pdf?src-supplier=Future+Electronics; ComponentLink6Description: https://datasheet.octopart.com:443/RC0805FR-07560RL-Yageo-datasheet-164759695.pdf?src-supplier=Future+Electronics; ComponentLink7URL: https://datasheet.octopart.com:443/RC0805FR-07560RL-Yageo-datasheet-12592811.pdf?src-supplier=Future+Electronics; ComponentLink7Description: https://datasheet.octopart.com:443/RC0805FR-07560RL-Yageo-datasheet-12592811.pdf?src-supplier=Future+Electronics; ComponentLink8URL: https://datasheet.octopart.com:443/RC0805FR-07560RL-Yageo-datasheet-8324252.pdf?src-supplier=Future+Electronics; ComponentLink8Description: https://datasheet.octopart.com:443/RC0805FR-07560RL-Yageo-datasheet-8324252.pdf?src-supplier=Future+Electronics; ComponentLink9URL: https://datasheet.octopart.com:443/RC0805FR-07560RL-Yageo-datasheet-79472498.pdf?src-supplier=Megastar; ComponentLink9Description: https://datasheet.octopart.com:443/RC0805FR-07560RL-Yageo-datasheet-79472498.pdf?src-supplier=Megastar; ComponentLink10URL: https://datasheet.octopart.com/RC0805FR-07560RL-Yageo-datasheet-73766026.pdf; ComponentLink10Description: https://datasheet.octopart.com/RC0805FR-07560RL-Yageo-datasheet-73766026.pdf; ComponentLink11URL: https://datasheet.octopart.com:443/RC0805FR-07560RL-Yageo-datasheet-118657.pdf?src-supplier=DigiKey; ComponentLink11Description: https://datasheet.octopart.com:443/RC0805FR-07560RL-Yageo-datasheet-118657.pdf?src-supplier=DigiKey; ComponentLink12URL: http://sigma.octopart.com:80/rohs_statement/Yageo-company-2.pdf?src-supplier=Compliance+Statements; ComponentLink12Description: http://sigma.octopart.com:80/rohs_statement/Yageo-company-2.pdf?src-supplier=Compliance+Statements; ComponentLink13URL: http://sigma.octopart.com:80/conflict_mineral_statement/Yageo-company-3.pdf?src-supplier=Compliance+Statements; ComponentLink13Description: http://sigma.octopart.com:80/conflict_mineral_statement/Yageo-company-3.pdf?src-supplier=Compliance+Statements; Supplier Part Number 1: 311-560CRCT-ND
R4 R14 R18-R21 = RC0805FR-0710KL: Res Thick Film 0805 10K Ohm 1% 0.125W(1/8W) +/-100ppm/C Epoxy Pad SMD T/R; Manufacturer: Yageo Group; Max Power Dissipation: 125mW; Resistance: 10kΩ; Temperature Coefficient: 100ppm/°C; Voltage Rating: 150V; Supplier 1: DigiKey; Manufacturer Part Number: RC0805FR-0710KL; RoHS: Compliant; Category: Chip SMD Resistors; Stock 1: 2814299; Pricing 1: 1=0.15, 10=0.016, 25=0.0136, 50=0.0112, 100=0.0071 (USD); Case/Package: 0805; Case Code (Imperial): 0805; China RoHS: Non-Compliant; Composition: Thick Film; Depth: 1.25mm; Features: Moisture Resistant; Height: 500µm; Lead Free: Lead Free; Length: 2mm; Lifecycle Status: Production; Max Operating Temperature: 155°C; Military Standard: Not; Min Operating Temperature: -55°C; Mount: Surface Mount; Number of Pins: 2; Number of Terminals: 2; Number of Terminations: 2; Packaging: Tape and Reel; Power Dissipation: 125mW; Power Rating: 125mW; REACH SVHC: Yes; Schedule B: 8533210045, 8533210045|8533210045|8533210045|8533210045|8533210045|8533210045|8533210045|8533210045|8533210045|8533210045|8533210045|8533210045|8533210045|8533210045|8533210045|8533210045|8533210045|8533210045|8533210045|8533210045|8533210045|8533210045|8533210045|85; Termination: SMD/SMT; Tolerance: 1%; Voltage Rating (AC): 150V; Width: 1.25mm; Working Voltage: 150V; ComponentLink1URL: https://datasheet.octopart.com:443/RC0805FR-0710KL-Yageo-datasheet-175887523.pdf?src-supplier=IHS; ComponentLink1Description: https://datasheet.octopart.com:443/RC0805FR-0710KL-Yageo-datasheet-175887523.pdf?src-supplier=IHS; ComponentLink2URL: https://datasheet.octopart.com:443/RC0805FR-0710KL-Yageo-datasheet-62067350.pdf?src-supplier=Farnell; ComponentLink2Description: https://datasheet.octopart.com:443/RC0805FR-0710KL-Yageo-datasheet-62067350.pdf?src-supplier=Farnell; ComponentLink3URL: https://datasheet.octopart.com:443/RC0805FR-0710KL-Yageo-datasheet-13691069.pdf?src-supplier=Farnell; ComponentLink3Description: https://datasheet.octopart.com:443/RC0805FR-0710KL-Yageo-datasheet-13691069.pdf?src-supplier=Farnell; ComponentLink4URL: https://datasheet.octopart.com:443/RC0805FR-0710KL-Yageo-datasheet-103092701.pdf?src-supplier=Upverter; ComponentLink4Description: https://datasheet.octopart.com:443/RC0805FR-0710KL-Yageo-datasheet-103092701.pdf?src-supplier=Upverter; ComponentLink5URL: https://datasheet.octopart.com:443/RC0805FR-0710KL-Yageo-datasheet-98239111.pdf?src-supplier=Upverter; ComponentLink5Description: https://datasheet.octopart.com:443/RC0805FR-0710KL-Yageo-datasheet-98239111.pdf?src-supplier=Upverter; ComponentLink6URL: https://datasheet.octopart.com:443/RC0805FR-0710KL-Yageo---Phycomp-datasheet-67302840.pdf?src-supplier=Upverter; ComponentLink6Description: https://datasheet.octopart.com:443/RC0805FR-0710KL-Yageo---Phycomp-datasheet-67302840.pdf?src-supplier=Upverter; ComponentLink7URL: https://datasheet.octopart.com:443/RC0805FR-0710KL-Yageo-datasheet-8330313.pdf?src-supplier=element14+APAC; ComponentLink7Description: https://datasheet.octopart.com:443/RC0805FR-0710KL-Yageo-datasheet-8330313.pdf?src-supplier=element14+APAC; ComponentLink8URL: https://datasheet.octopart.com:443/RC0805FR-0710KL-Yageo-datasheet-12592811.pdf?src-supplier=element14+APAC; ComponentLink8Description: https://datasheet.octopart.com:443/RC0805FR-0710KL-Yageo-datasheet-12592811.pdf?src-supplier=element14+APAC; ComponentLink9URL: https://datasheet.octopart.com:443/RC0805FR-0710KL-Yageo-datasheet-164759695.pdf?src-supplier=Future+Electronics; ComponentLink9Description: https://datasheet.octopart.com:443/RC0805FR-0710KL-Yageo-datasheet-164759695.pdf?src-supplier=Future+Electronics; ComponentLink10URL: https://datasheet.octopart.com:443/RC0805FR-0710KL-Yageo-datasheet-15800360.pdf?src-supplier=Future+Electronics; ComponentLink10Description: https://datasheet.octopart.com:443/RC0805FR-0710KL-Yageo-datasheet-15800360.pdf?src-supplier=Future+Electronics; ComponentLink11URL: https://datasheet.octopart.com:443/RC0805FR-0710KL-Yageo-datasheet-8324252.pdf?src-supplier=Future+Electronics; ComponentLink11Description: https://datasheet.octopart.com:443/RC0805FR-0710KL-Yageo-datasheet-8324252.pdf?src-supplier=Future+Electronics; ComponentLink12URL: https://datasheet.octopart.com:443/RC0805FR-0710KL-Yageo-datasheet-79472498.pdf?src-supplier=Megastar; ComponentLink12Description: https://datasheet.octopart.com:443/RC0805FR-0710KL-Yageo-datasheet-79472498.pdf?src-supplier=Megastar; ComponentLink13URL: https://datasheet.octopart.com:443/RC0805FR-0710KL-Yageo-datasheet-27714392.pdf?src-supplier=Seeed+Studio; ComponentLink13Description: https://datasheet.octopart.com:443/RC0805FR-0710KL-Yageo-datasheet-27714392.pdf?src-supplier=Seeed+Studio; ComponentLink14URL: https://datasheet.octopart.com/RC0805FR-0710KL-Yageo-datasheet-73766026.pdf; ComponentLink14Description: https://datasheet.octopart.com/RC0805FR-0710KL-Yageo-datasheet-73766026.pdf; ComponentLink15URL: https://datasheet.octopart.com:443/RC0805FR-0710KL-Yageo-datasheet-118657.pdf?src-supplier=DigiKey; ComponentLink15Description: https://datasheet.octopart.com:443/RC0805FR-0710KL-Yageo-datasheet-118657.pdf?src-supplier=DigiKey; ComponentLink16URL: https://datasheet.octopart.com:443/RC0805FR-0710KL-Yageo-datasheet-502840.pdf?src-supplier=element14; ComponentLink16Description: https://datasheet.octopart.com:443/RC0805FR-0710KL-Yageo-datasheet-502840.pdf?src-supplier=element14; ComponentLink17URL: http://sigma.octopart.com:80/rohs_statement/Yageo-company-2.pdf?src-supplier=Compliance+Statements; ComponentLink17Description: http://sigma.octopart.com:80/rohs_statement/Yageo-company-2.pdf?src-supplier=Compliance+Statements; ComponentLink18URL: http://sigma.octopart.com:80/conflict_mineral_statement/Yageo-company-3.pdf?src-supplier=Compliance+Statements; ComponentLink18Description: http://sigma.octopart.com:80/conflict_mineral_statement/Yageo-company-3.pdf?src-supplier=Compliance+Statements; Supplier Part Number 1: 311-10.0KCRDKR-ND